# Altium schematic sheet ScopeVideo.SchDoc: CRT Video Amp Bias Supply
size Letter; Organization: ES; Revision: A; SheetNumber: 1; SheetTotal: 1
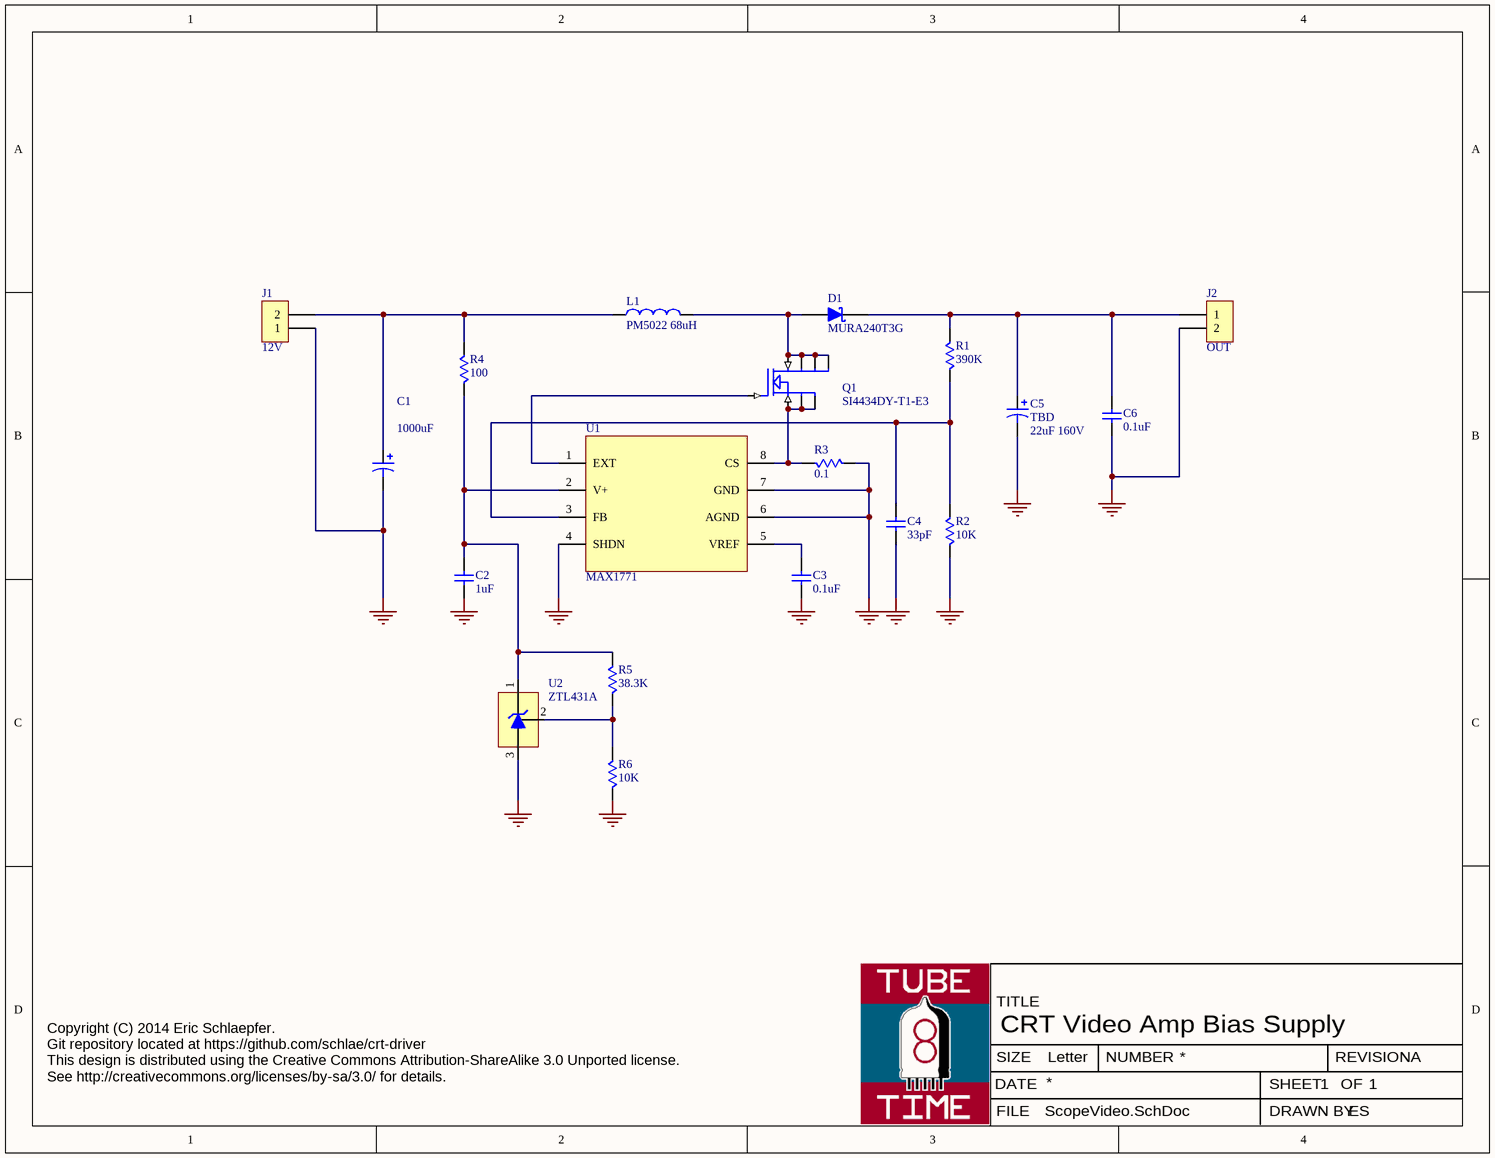
[diagram p0: ScopeVideo.SchDoc]

## Parts
C1  value 1000uF  [CAP_R200x400]  (hidden comment: Cap Pol2)
C2  value 1uF  [G_0805[2012]]  (hidden comment: Cap)
C3  value 0.1uF  [G_0805[2012]]  (hidden comment: Cap)
C4  value 33pF  [G_0805[2012]]  (hidden comment: Cap)
C5  TBD  value 22uF 160V  [CAP_R200x400]
C6  value 0.1uF  [G_1206[3216]]  (hidden comment: Cap)
D1  MURA240T3G  [G_SMB]
J1  12V  [HDR2S156]
J2  OUT  [HDR3SM1]
L1  PM5022 68uH  [IND1]
Q1  SI4434DY-T1-E3  [G_SO8]
R1  value 390K  [G_0805[2012]]  (hidden comment: Res1)
R2  value 10K  [G_0805[2012]]  (hidden comment: Res1)
R3  value 0.1  [G_1210[3225]]  (hidden comment: Res1)
R4  value 100  [G_0805[2012]]  (hidden comment: Res1)
R5  value 38.3K  [G_0805[2012]]  (hidden comment: Res1)
R6  value 10K  [G_0805[2012]]  (hidden comment: Res1)
U1  MAX1771  [G_SO8]
U2  ZTL431A  [G_SOT23]

## Nets
GND: C1.2 C2.1 C3.1 C4.1 C5.2 C6.1 J1.1 J2.2 R2.2 R3.2 R6.2 U1.4(SHDN) U1.6(AGND) U1.7(GND) U2.3(A)
NetC1_1: C1.1 J1.2 L1.1 R4.1
NetC2_2: C2.2 R4.2 R5.1 U1.2(V+) U2.1(C)
NetC3_2: C3.2 U1.5(VREF)
NetC4_2: C4.2 R1.2 R2.1 U1.3(FB)
NetC5_1: C5.1 C6.2 D1.K J2.1 R1.1
NetD1_A: D1.A L1.2 Q1.5(D) Q1.6(D) Q1.7(D) Q1.8(D)
NetQ1_1: Q1.1(S) Q1.2(S) Q1.3(S) R3.1 U1.8(CS)
NetQ1_4: Q1.4(G) U1.1(EXT)
NetR5_2: R5.2 R6.1 U2.2(REF)

## Notes on the sheet
- Copyright (C) 2014 Eric Schlaepfer.
  Git repository located at https://github.com/schlae/crt-driver
  This design is distributed using the Creative Commons Attribution-ShareAlike 3.0 Unported license.
  See http://creativecommons.org/licenses/by-sa/3.0/ for details.
- TITLE
- DATE
- SIZE
- Letter
- NUMBER
- SHEET
- REVISION
- OF
- FILE
- DRAWN BY

## Library data of the parts
C1 = CapP: Polarized Capacitor; ManufPart: UVR1E102MPD; Mouser: 647-UVR1E102MPD
C2 = Cap: Capacitor; ManufPart: C2012X7R1E105K125AB; Mouser: 810-C2012X7R1E105K
C3 C4 = Cap: Capacitor
  C3: Mouser: 810-C2012X8R1H104K
  C4: Mouser: 581-08055A330J
C5 = CapP: Polarized Capacitor; ManufPart: EEU-EE2C220; Mouser: 667-EEU-EE2C220
C6 = Cap: Capacitor; ManufPart: C3216X7R2E104K160AA; Mouser: 810-C3216X7R2E104K
D1 = D Schottky: Schottky Diode; ManufPart: MURA240T3G; Mouser: 863-MURA240T3G
J1 J2 = CON2: Connector, 2 pin
  J1: Mouser: 538-26-48-1021
  J2: Mouser: 538-42375-1863
L1 = INDUCTOR: ManufPart: PM5022-680M-RC; Mouser: 542-PM5022-680M-RC
Q1 = MOSFET N SO8: N-channel MOSFET (8-SOIC); ManufPart: SI4434DY-T1-E3; Mouser: 781-SI4434DY-T1-E3
R1 = Res: Resistor; ManufPart: CRCW0805390KFKEA; Mouser: 71-CRCW0805390KFKEA
R2 R6 = Res: Resistor; ManufPart: CRCW080510K0FKEB; Mouser: 71-CRCW080510K0FKEB
R3 = Res: Resistor; ManufPart: 73L5R10J; Mouser: 774-73L5R10J
R4 = Res: Resistor; ManufPart: CRCW0805100RFKEA; Mouser: 71-CRCW0805-100-E3
R5 = Res: Resistor; ManufPart: CRCW080538K3FKEA; Mouser: 71-CRCW0805-38.3K-E3
U1 = MAX1771: MAX1771 Boost Converter; ManufPart: MAX1771CSA+; Mouser: 700-MAX1771CSA
U2 = TL431: Adjustable Shunt Reg; ManufPart: ZTL431AFFTA; Mouser: 522-ZTL431AFTA